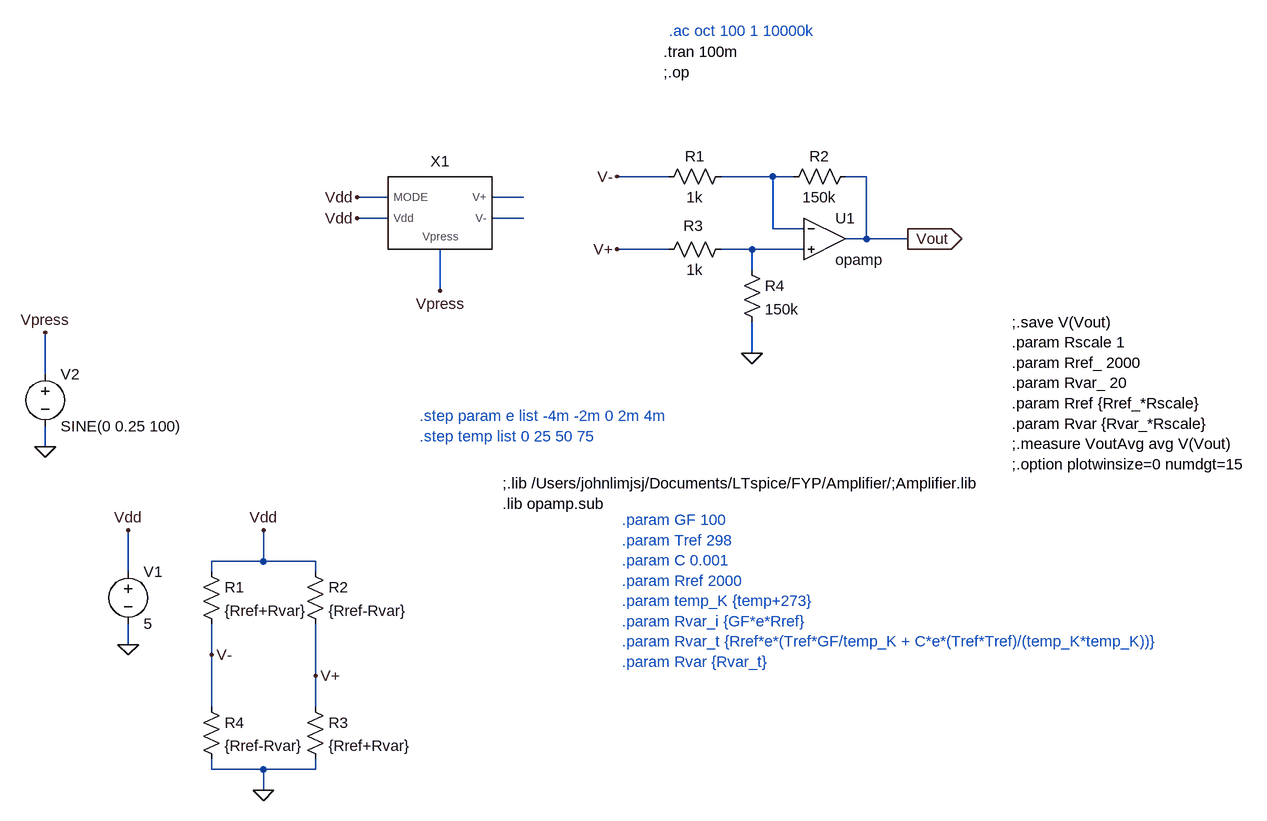
[diagram p0: schematic PZR_subtractor.asc]
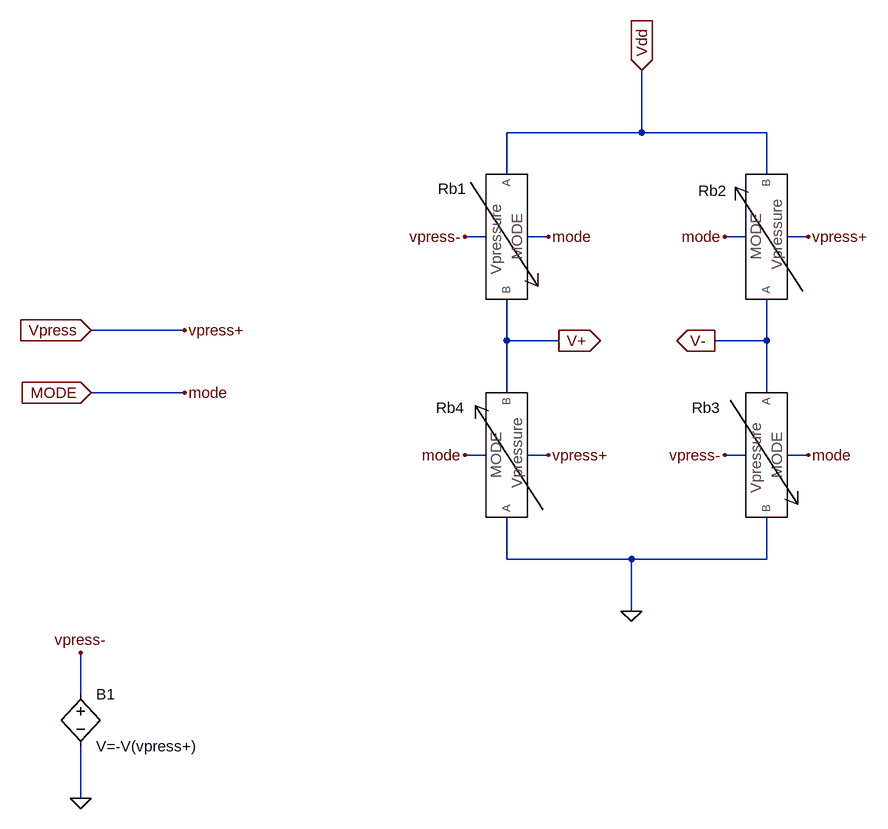
[diagram p1: sub-circuit com_wheatstone.asc]
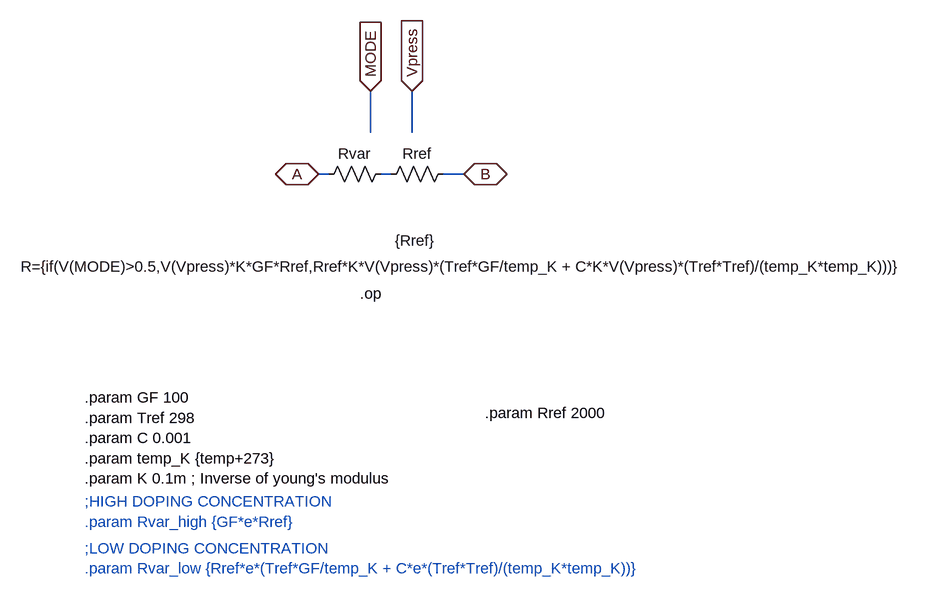
[diagram p2: sub-circuit sensor_res.asc]
PZR_subtractor.asc, the LTspice schematic file:
Version 4
SHEET 1 1700 1168
WIRE 448 208 368 208
WIRE 608 208 528 208
WIRE 640 208 608 208
WIRE 752 208 720 208
WIRE 16 240 -32 240
WIRE 224 240 176 240
WIRE 16 272 -32 272
WIRE 224 272 176 272
WIRE 608 288 608 208
WIRE 656 288 608 288
WIRE 752 304 752 208
WIRE 752 304 720 304
WIRE 816 304 752 304
WIRE 448 320 368 320
WIRE 576 320 528 320
WIRE 656 320 576 320
WIRE 576 352 576 320
WIRE 96 384 96 320
WIRE 576 480 576 432
WIRE -512 512 -512 448
WIRE -512 624 -512 592
WIRE -176 800 -176 752
WIRE -176 800 -256 800
WIRE -96 800 -176 800
WIRE -384 816 -384 752
WIRE -256 816 -256 800
WIRE -96 816 -96 800
WIRE -384 928 -384 896
WIRE -256 944 -256 896
WIRE -96 976 -96 896
WIRE -256 1024 -256 944
WIRE -96 1024 -96 976
WIRE -256 1120 -256 1104
WIRE -176 1120 -256 1120
WIRE -96 1120 -96 1104
WIRE -96 1120 -176 1120
WIRE -176 1152 -176 1120
FLAG -384 928 0
FLAG 576 480 0
FLAG 816 304 Vout
IOPIN 816 304 Out
FLAG -176 1152 0
FLAG -256 944 V-
FLAG -96 976 V+
FLAG -384 752 Vdd
FLAG -32 272 Vdd
FLAG -32 240 Vdd
FLAG -512 624 0
FLAG -512 448 Vpress
FLAG 96 384 Vpress
FLAG -176 752 Vdd
FLAG 368 208 V-
FLAG 368 320 V+
SYMBOL res -272 800 R0
SYMATTR InstName R1
SYMATTR Value {Rref+Rvar}
SYMBOL res -112 800 R0
SYMATTR InstName R2
SYMATTR Value {Rref-Rvar}
SYMBOL res -112 1008 R0
SYMATTR InstName R3
SYMATTR Value {Rref+Rvar}
SYMBOL res -272 1008 R0
SYMATTR InstName R4
SYMATTR Value {Rref-Rvar}
SYMBOL voltage -384 800 R0
SYMATTR InstName V1
SYMATTR Value 5
SYMATTR Value2 AC 10
SYMBOL Opamps/opamp 688 240 R0
SYMATTR InstName U1
SYMBOL res 560 336 R0
SYMATTR InstName R4
SYMATTR Value 150k
SYMBOL res 736 192 R90
WINDOW 0 0 56 VBottom 2
WINDOW 3 32 56 VTop 2
SYMATTR InstName R2
SYMATTR Value 150k
SYMBOL res 544 304 R90
WINDOW 0 -5 58 VBottom 2
WINDOW 3 32 56 VTop 2
SYMATTR InstName R3
SYMATTR Value 1k
SYMBOL res 544 192 R90
WINDOW 0 0 56 VBottom 2
WINDOW 3 32 56 VTop 2
SYMATTR InstName R1
SYMATTR Value 1k
SYMBOL COM_WHEATSTONE 96 256 R0
SYMATTR InstName X1
SYMBOL voltage -512 496 R0
SYMATTR InstName V2
SYMATTR Value SINE(0 0.25 100)
SYMATTR Value2 AC 10
TEXT 192 680 Left 2 !;.lib /Users/johnlimjsj/Documents/LTspice/FYP/Amplifier/;Amplifier.lib\n.lib opamp.sub
TEXT 976 432 Left 2 !;.save V(Vout)\n.param Rscale 1\n.param Rref_ 2000\n.param Rvar_ 20\n.param Rref {Rref_*Rscale}\n.param Rvar {Rvar_*Rscale}\n;.measure VoutAvg avg V(Vout)\n;.option plotwinsize=0 numdgt=15
TEXT 440 16 Left 2 !.tran 100m\n;.op
TEXT 448 -16 Left 2 ;.ac oct 100 1 10000k
TEXT 64 576 Left 2 ;.step param e list -4m -2m 0 2m 4m\n.step temp list 0 25 50 75
TEXT 376 736 Left 2 ;.param GF 100\n.param Tref 298\n.param C 0.001\n.param Rref 2000\n.param temp_K {temp+273}\n.param Rvar_i {GF*e*Rref}\n.param Rvar_t {Rref*e*(Tref*GF/temp_K + C*e*(Tref*Tref)/(temp_K*temp_K))}\n.param Rvar {Rvar_t}

com_wheatstone.asc, the sub-circuit schematic file:
Version 4
SHEET 1 1064 1200
WIRE 448 112 448 16
WIRE 448 112 240 112
WIRE 640 112 448 112
WIRE 240 176 240 112
WIRE 640 176 640 112
WIRE 208 272 176 272
WIRE 304 272 272 272
WIRE 608 272 576 272
WIRE 704 272 672 272
WIRE -256 416 -400 416
WIRE 240 432 240 368
WIRE 320 432 240 432
WIRE 640 432 640 368
WIRE 640 432 560 432
WIRE -256 512 -400 512
WIRE 240 512 240 432
WIRE 640 512 640 432
WIRE 208 608 176 608
WIRE 304 608 272 608
WIRE 608 608 576 608
WIRE 704 608 672 608
WIRE 240 768 240 704
WIRE 432 768 240 768
WIRE 640 768 640 704
WIRE 640 768 432 768
WIRE 432 848 432 768
WIRE -416 976 -416 912
WIRE -416 1136 -416 1056
FLAG 432 848 0
FLAG 176 608 mode
FLAG 304 272 mode
FLAG 704 608 mode
FLAG 576 272 mode
FLAG 304 608 vpress+
FLAG 704 272 vpress+
FLAG 576 608 vpress-
FLAG 176 272 vpress-
FLAG 448 16 Vdd
IOPIN 448 16 In
FLAG 320 432 V+
IOPIN 320 432 Out
FLAG 560 432 V-
IOPIN 560 432 Out
FLAG -416 1136 0
FLAG -416 912 vpress-
FLAG -400 416 Vpress
IOPIN -400 416 In
FLAG -256 416 vpress+
FLAG -400 512 MODE
IOPIN -400 512 In
FLAG -256 512 mode
SYMBOL SENSOR_RES 224 608 R270
WINDOW 0 57 -71 VTop 2
SYMATTR InstName Rb4
SYMBOL SENSOR_RES 656 608 R90
WINDOW 0 -88 109 VTop 2
SYMATTR InstName Rb3
SYMBOL SENSOR_RES 256 272 R90
WINDOW 0 -89 100 VTop 2
SYMATTR InstName Rb1
SYMBOL SENSOR_RES 624 272 R270
WINDOW 0 55 -67 VTop 2
SYMATTR InstName Rb2
SYMBOL bv -416 960 R0
SYMATTR InstName B1
SYMATTR Value V=-V(vpress+)

sensor_res.asc, the sub-circuit schematic file:
Version 4
SHEET 1 1248 1508
WIRE 400 272 400 208
WIRE 464 272 464 208
WIRE 336 336 320 336
WIRE 432 336 416 336
WIRE 544 336 512 336
FLAG 464 208 Vpress
IOPIN 464 208 In
FLAG 400 208 MODE
IOPIN 400 208 In
FLAG 320 336 A
IOPIN 320 336 BiDir
FLAG 544 336 B
IOPIN 544 336 BiDir
SYMBOL res 432 320 R90
WINDOW 0 0 56 VBottom 2
WINDOW 3 143 -113 VTop 2
SYMATTR InstName Rvar
SYMATTR Value R={if(V(MODE)>0.5,V(Vpress)*K*GF*Rref,Rref*K*V(Vpress)*(Tref*GF/temp_K + C*K*V(Vpress)*(Tref*Tref)/(temp_K*temp_K)))}
SYMBOL res 528 320 R90
WINDOW 0 0 56 VBottom 2
WINDOW 3 103 59 VTop 2
SYMATTR InstName Rref
SYMATTR Value {Rref}
TEXT -40 680 Left 2 !.param GF 100\n.param Tref 298\n.param C 0.001\n.param temp_K {temp+273}\n.param K 0.1m ; Inverse of young's modulus
TEXT -40 912 Left 2 ;;LOW DOPING CONCENTRATION\n.param Rvar_low {Rref*e*(Tref*GF/temp_K + C*e*(Tref*Tref)/(temp_K*temp_K))}
TEXT -40 840 Left 2 ;;HIGH DOPING CONCENTRATION\n.param Rvar_high {GF*e*Rref}
TEXT 576 704 Left 2 !.param Rref 2000
TEXT 384 520 Left 2 !.op

The netlist it stands for:
* PZR_subtractor.asc
R1 Vdd V- {Rref+Rvar}
R2 Vdd V+ {Rref-Rvar}
R3 V+ 0 {Rref+Rvar}
R4 V- 0 {Rref-Rvar}
V1 Vdd 0 5 AC 10
XU1 N001 N004 Vout opamp Aol=100K GBW=10Meg  ; pins invin noninvin out
R4 N004 0 150k
R2 Vout N001 150k
R3 N004 V+ 1k
R1 N001 V- 1k
XX1 Vdd Vdd Vpress N002 N003 com_wheatstone
V2 Vpress 0 SINE(0 0.25 100) AC 10

* block symbol definitions
.subckt com_wheatstone MODE Vdd Vpress V+ V-
XRb4 mode Vpress 0 V+ sensor_res
XRb3 mode vpress- V- 0 sensor_res
XRb1 mode vpress- Vdd V+ sensor_res
XRb2 mode Vpress V- Vdd sensor_res
B1 vpress- 0 V=-V(vpress+)
.ends com_wheatstone

.subckt sensor_res MODE Vpress A B
Rvar N001 A R={if(V(MODE)>0.5,V(Vpress)*K*GF*Rref,Rref*K*V(Vpress)*(Tref*GF/temp_K + C*K*V(Vpress)*(Tref*Tref)/(temp_K*temp_K)))}
Rref B N001 {Rref}
.param GF 100
.param Tref 298
.param C 0.001
.param temp_K {temp+273}
.param K 0.1m ; Inverse of young's modulus
* ;LOW DOPING CONCENTRATION
* .param Rvar_low {Rref*e*(Tref*GF/temp_K + C*e*(Tref*Tref)/(temp_K*temp_K))}
* ;HIGH DOPING CONCENTRATION
* .param Rvar_high {GF*e*Rref}
.param Rref 2000
.op
.ends sensor_res

;.lib /Users/johnlimjsj/Documents/LTspice/FYP/Amplifier/;Amplifier.lib
.lib opamp.sub
;.save V(Vout)
.param Rscale 1
.param Rref_ 2000
.param Rvar_ 20
.param Rref {Rref_*Rscale}
.param Rvar {Rvar_*Rscale}
;.measure VoutAvg avg V(Vout)
;.option plotwinsize=0 numdgt=15
.tran 100m
;.op
* .ac oct 100 1 10000k
* .step param e list -4m -2m 0 2m 4m
* .step temp list 0 25 50 75
* .param GF 100
* .param Tref 298
* .param C 0.001
* .param Rref 2000
* .param temp_K {temp+273}
* .param Rvar_i {GF*e*Rref}
* .param Rvar_t {Rref*e*(Tref*GF/temp_K + C*e*(Tref*Tref)/(temp_K*temp_K))}
* .param Rvar {Rvar_t}
.backanno
.end